# EAGLE design PayloadV7sch (EAGLE 7.3.0)
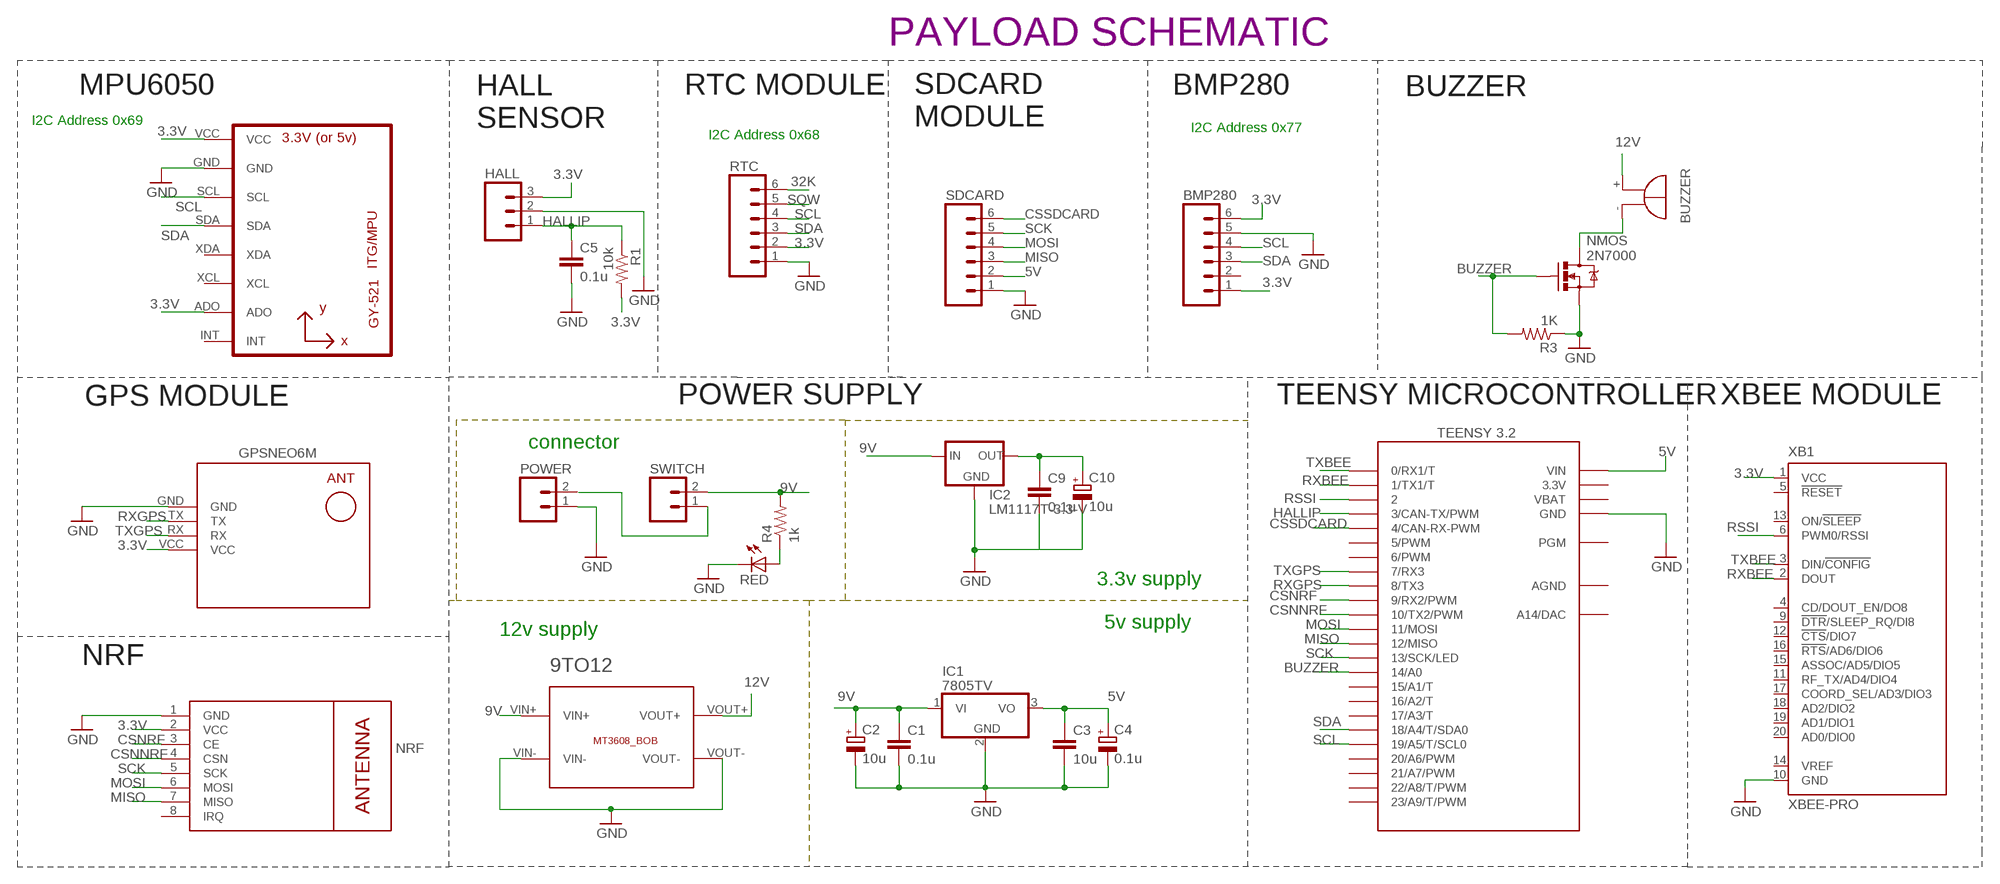
[diagram p0: schematic, sheet 1]

## Parts
9TO12  BREAKOUTS_MT3608_BOB  [BREAKOUTS_MT3608_BOB]
BMP280  M06  [06P]
C1  0.1u  C-EU025-025X050  [C025-025X050]
C2  10u  CPOL-EUE2.5-6  [E2,5-6]
C3  10u  C-EU025-025X050  [C025-025X050]
C4  0.1u  CPOL-EUE2.5-6  [E2,5-6]
C5  0.1u  C-EU025-025X050  [C025-025X050]
C9  0.1u  C-EU025-025X050  [C025-025X050]
C10  10u  CPOL-EUE2.5-6  [E2,5-6]
HALL  M03  [03P]
IC1  7805TV  [TO220V]
IC2  LM1117T-3.3-V  [TO220V]
M1  WIRELESS-NRF24L01  [WIRELESS-NRF24L01]
POWER  CEDT_JANUARY_2015_V5_M02  [CEDT_JANUARY_2015_V5_02P]
Q1  SPARKFUN-DISCRETESEMI_MOSFET-NCHANNEL2N7000  [SPARKFUN-DISCRETESEMI_TO-92]
R1  10k  R-US_0204/7  [0204/7]
R3  1K  R-US_0204/7  [0204/7]
R4  1k  R-US_0204/7  [0204/7]
RED  red  LED3MM  [LED3MM]
RTC  M06  [06P]
SDCARD  M06  [06P]
SG1  BUZZER_EB2209A  [BUZZER_EB2209A]
SWITCH  CEDT_JANUARY_2015_V5_M02  [CEDT_JANUARY_2015_V5_02P]
U1  GY-521MPU6050  [GY-521]
U$2  TEENSY_3.1-3.2_OUTER_ROW  [TEENSY_3.0-3.2&LC_OUTER_ROW]
U$3  GPS-RECEIVER-NEO6M  [GPS-RECEIVER-NEO6M]
XB1  XBEE-PRO  [XBEE-PRO]

## Nets
3.3V: BMP280.1 BMP280.6 C9.1 C10.+ HALL.3 IC2.2(OUT) M1.2(VCC) R1.2 RTC.2 U1.ADO U1.VCC U$3.VCC XB1.1(VCC)
5V: C3.1 C4.+ IC1.3(VO) SDCARD.2 U$2.VIN
9V: 9TO12.VIN+ C1.1 C2.+ IC1.1(VI) IC2.3(IN) R4.2
12V: 9TO12.VOUT+ SG1.+
32K: RTC.6
BUZZER: Q1.2(G) R3.2 U$2.14/A0
CSNNRF: M1.4(CSN) U$2.10(10/TX2/PWM)
CSNRF: M1.3(CE) U$2.9(9/RX2/PWM)
CSSDCARD: SDCARD.6 U$2.4(4/CAN-RX-PWM)
GND: 9TO12.VIN- 9TO12.VOUT- BMP280.5 C1.2 C2.- C3.2 C4.- C5.2 C9.2 C10.- HALL.2 IC1.2(GND) IC2.1(GND) M1.1(GND) POWER.1 Q1.1(S) R3.1 RED.K(C) RTC.1 SDCARD.1 U1.GND U$2.GND U$2.GND1(GND) U$3.GND XB1.10(GND)
HALLIP: C5.1 HALL.1 R1.1 U$2.3(3/CAN-TX/PWM)
MISO: M1.7(MISO) SDCARD.3 U$2.12(12/MISO)
MOSI: M1.6(MOSI) SDCARD.4 U$2.11(11/MOSI)
N$2: R4.1 RED.A
N$3: Q1.3(D) SG1.-
RSSI: U$2.2 XB1.6(PWM0/RSSI)
RXBEE: U$2.1(1/TX1/T) XB1.2(DOUT)
RXGPS: U$2.8(8/TX3) U$3.TX
SCK: M1.5(SCK) SDCARD.5 U$2.13(13/SCK/LED)
SCL: BMP280.4 RTC.4 U1.SCL U$2.19/A5(19/A5/T/SCL0)
SDA: BMP280.3 RTC.3 U1.SDA U$2.18/A4(18/A4/T/SDA0)
SQW: RTC.5
TXBEE: U$2.0(0/RX1/T) XB1.3(DIN/!CONFIG)
TXGPS: U$2.7(7/RX3) U$3.RX
Unconnected: BMP280.2 M1.8(IRQ) POWER.2 SWITCH.1 SWITCH.2 U1.INT U1.XCL U1.XDA U$2.5(5/PWM) U$2.6(6/PWM) U$2.15/A1(15/A1/T) U$2.16/A2(16/A2/T) U$2.17/A3(17/A3/T) U$2.20/A6(20/A6/PWM) U$2.21/A7(21/A7/PWM) U$2.22/A8(22/A8/T/PWM) U$2.23/A9(23/A9/T/PWM) U$2.PGM U$2.RESET/DAC(A14/DAC) XB1.4(CD/DOUT_EN/DO8) XB1.5(!RESET) XB1.9(!DTR!/SLEEP_RQ/DI8) XB1.11(RF_TX/AD4/DIO4) XB1.12(!CTS!/DIO7) XB1.13(ON/!SLEEP) XB1.14(VREF) XB1.15(ASSOC/AD5/DIO5) XB1.16(!RTS!/AD6/DIO6) XB1.17(COORD_SEL/AD3/DIO3) XB1.18(AD2/DIO2) XB1.19(AD1/DIO1) XB1.20(AD0/DIO0)

## Notes on the sheet
- PAYLOAD SCHEMATIC
- MPU6050 | RTC MODULE | BMP280 | BUZZER
- I2C Address 0x69
- SDCARD
  MODULE
- HALL
  SENSOR
- I2C Address 0x77
- I2C Address 0x68
- GPS MODULE | POWER SUPPLY | TEENSY MICROCONTROLLER | XBEE MODULE
- connector
- 3.3v supply
- 5v supply
- 12v supply
- NRF

## Power pins joined to a net without a drawn wire
3.3V: U$2.3.3V U$2.3.3V1(3.3V)
AGND: U$2.AGND
VBAT: U$2.VBAT

## Library data of the parts
9TO12 = Cansat2019_3279_Container_v01:BREAKOUTS_MT3608_BOB
BMP280 RTC SDCARD = con-amp-quick:M06: AMP QUICK CONNECTOR; OC_FARNELL: unknown; OC_NEWARK: unknown
C1 C3 C5 C9 = resistor:C-EU: CAPACITOR, European symbol
C2 C4 C10 = rcl:CPOL-EU: POLARIZED CAPACITOR, European symbol; SPICEPREFIX: C
HALL = con-amp-quick:M03: AMP QUICK CONNECTOR; OC_FARNELL: unknown; OC_NEWARK: unknown
IC1 = linear:78*: Positive VOLTAGE REGULATOR Source: http://cache.national.com/ds/LM/LM78L05.pdf http://www.fairchildsemi.com/ds/LM/LM7805.pdf
IC2 = lm1117:LM1117T-*
M1 = diy-modules:WIRELESS-NRF24L01: 2.4 GHz Wireless Module based on NRF24L01 chip More details available here: http://www.electrodragon.com/w/NRF24L01 Click here to find device on ebay.com <http://www.ebay.com/sch/nrf24l01+arduino>
POWER SWITCH = Cansat2019_3279_Container_v01:CEDT_JANUARY_2015_V5_M02: AMP QUICK CONNECTOR
Q1 = Cansat2019_3279_Container_v01:SPARKFUN-DISCRETESEMI_MOSFET-NCHANNEL: Common NMOSFET Parts MFG P/N Store ID Prod ID FDD8780 TRANS-09984 SI7820DN TRANS-11055 FDS6630A IC-08089 2N7002PW TRANS-11151 FQP30N06L COM-10213 TRANS-10060 BSS123LT1G TRANS-08345 BSS138 TRANS-00830 BS170 2N7000
R1 R3 R4 = rcl:R-US_: RESISTOR, American symbol; SPICEPREFIX: R
RED = CEDT_JANUARY_2015_v5:LED
SG1 = Cansat2019_3279_Container_v01:BUZZER_EB2209A: BUZZER Source: Buerklin; OC_FARNELL: unknown; OC_NEWARK: unknown
U1 = gy-521:GY-521
U$2 = Teensy_3_and_LC_Series_Boards_v1.4:TEENSY_3.1-3.2_OUTER_ROW: Footprint for Teensy 3.1 or 3.2 board using all pin connections on the outer perimeter
U$3 = diy-modules:GPS-RECEIVER-NEO6M: GPS Receiver Module based on NEO-6 device Short tutorial how to use NEO-6 module with Arduino: http://www.xarg.org/2016/06/neo6mv2-gps-module-with-arduino/ NEO-6 datasheet is available here: https://www.u-blox.com/sites/default/files/products/documents/NEO-6_DataSheet_%28GPS.G6-HW-09005%29.pdf Click here to find device on ebay.com <http://www.ebay.com/sch/gyneo6mv2>
XB1 = maxstream:XBEE: XBee (TM) /XBee-PRO(TM) OEM RF Modules Source: MaxStream, Inc. xbee_productmanual.pdf; MPN: XBP24-AWI-001; OC_FARNELL: 1337916; OC_NEWARK: 42M2667

## Board
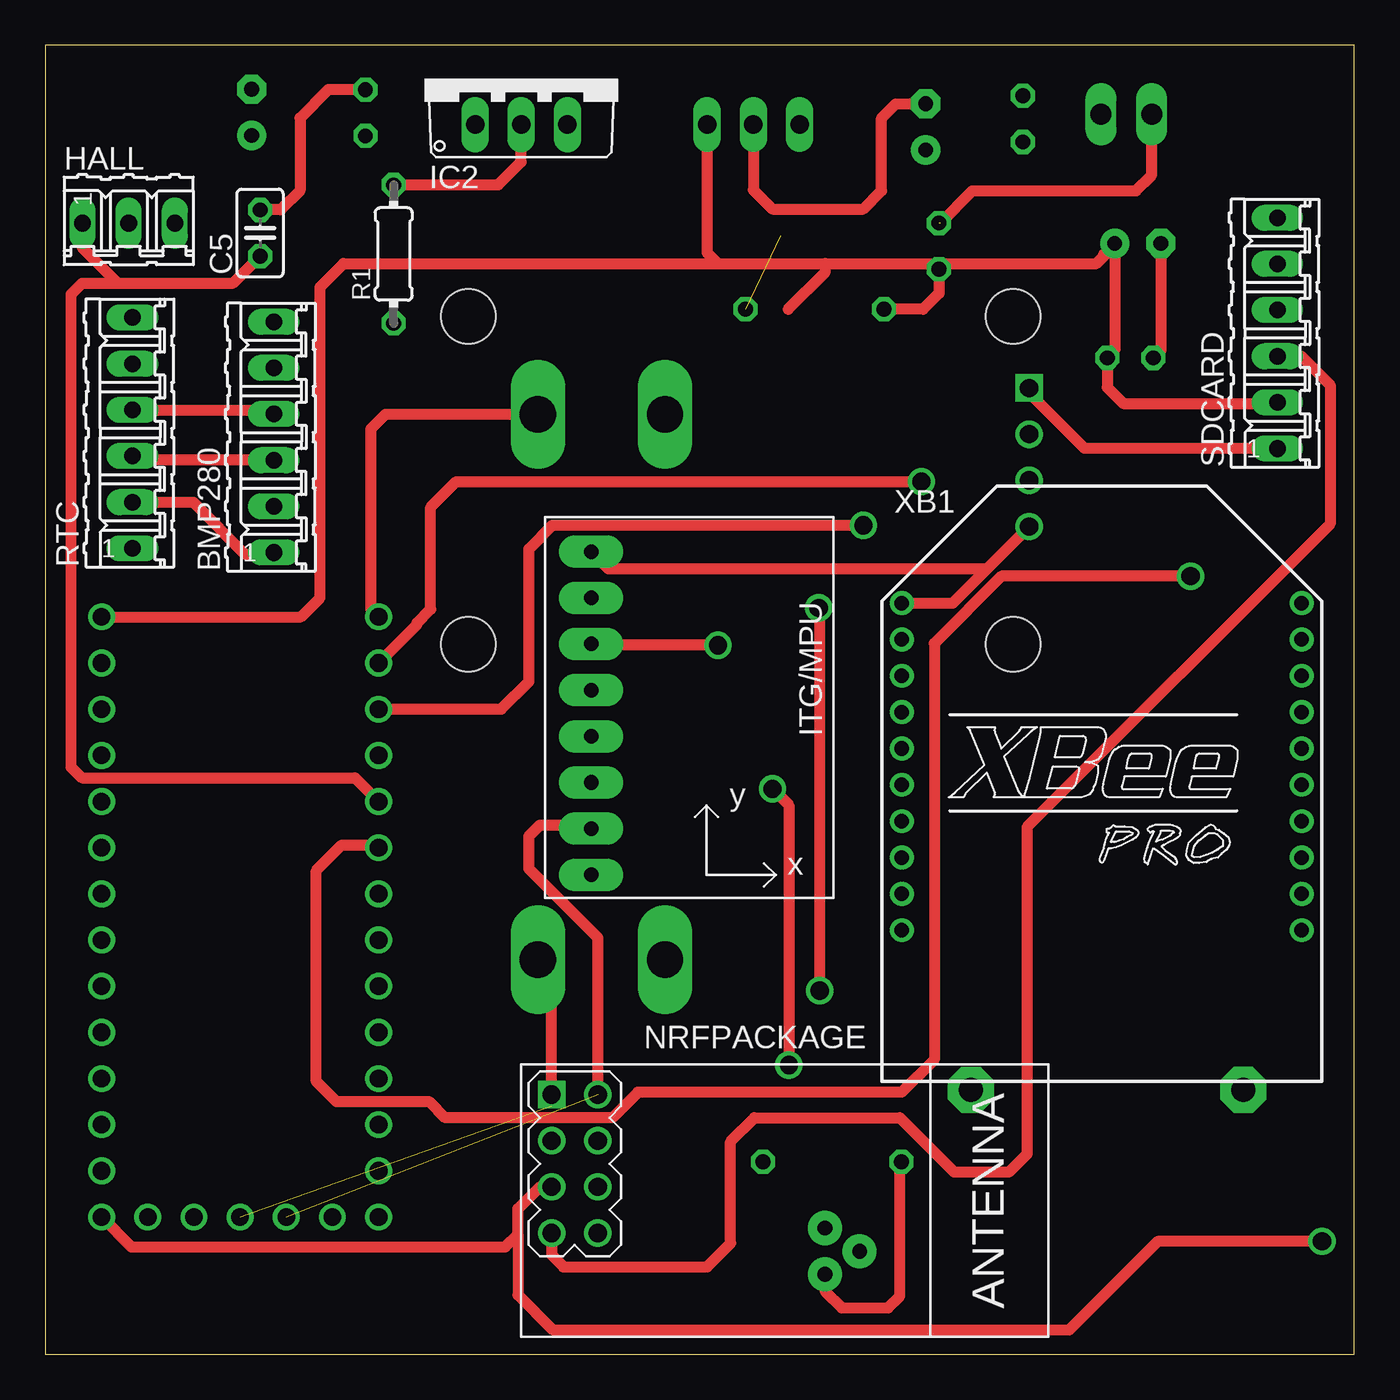
[diagram p1: board, top side]
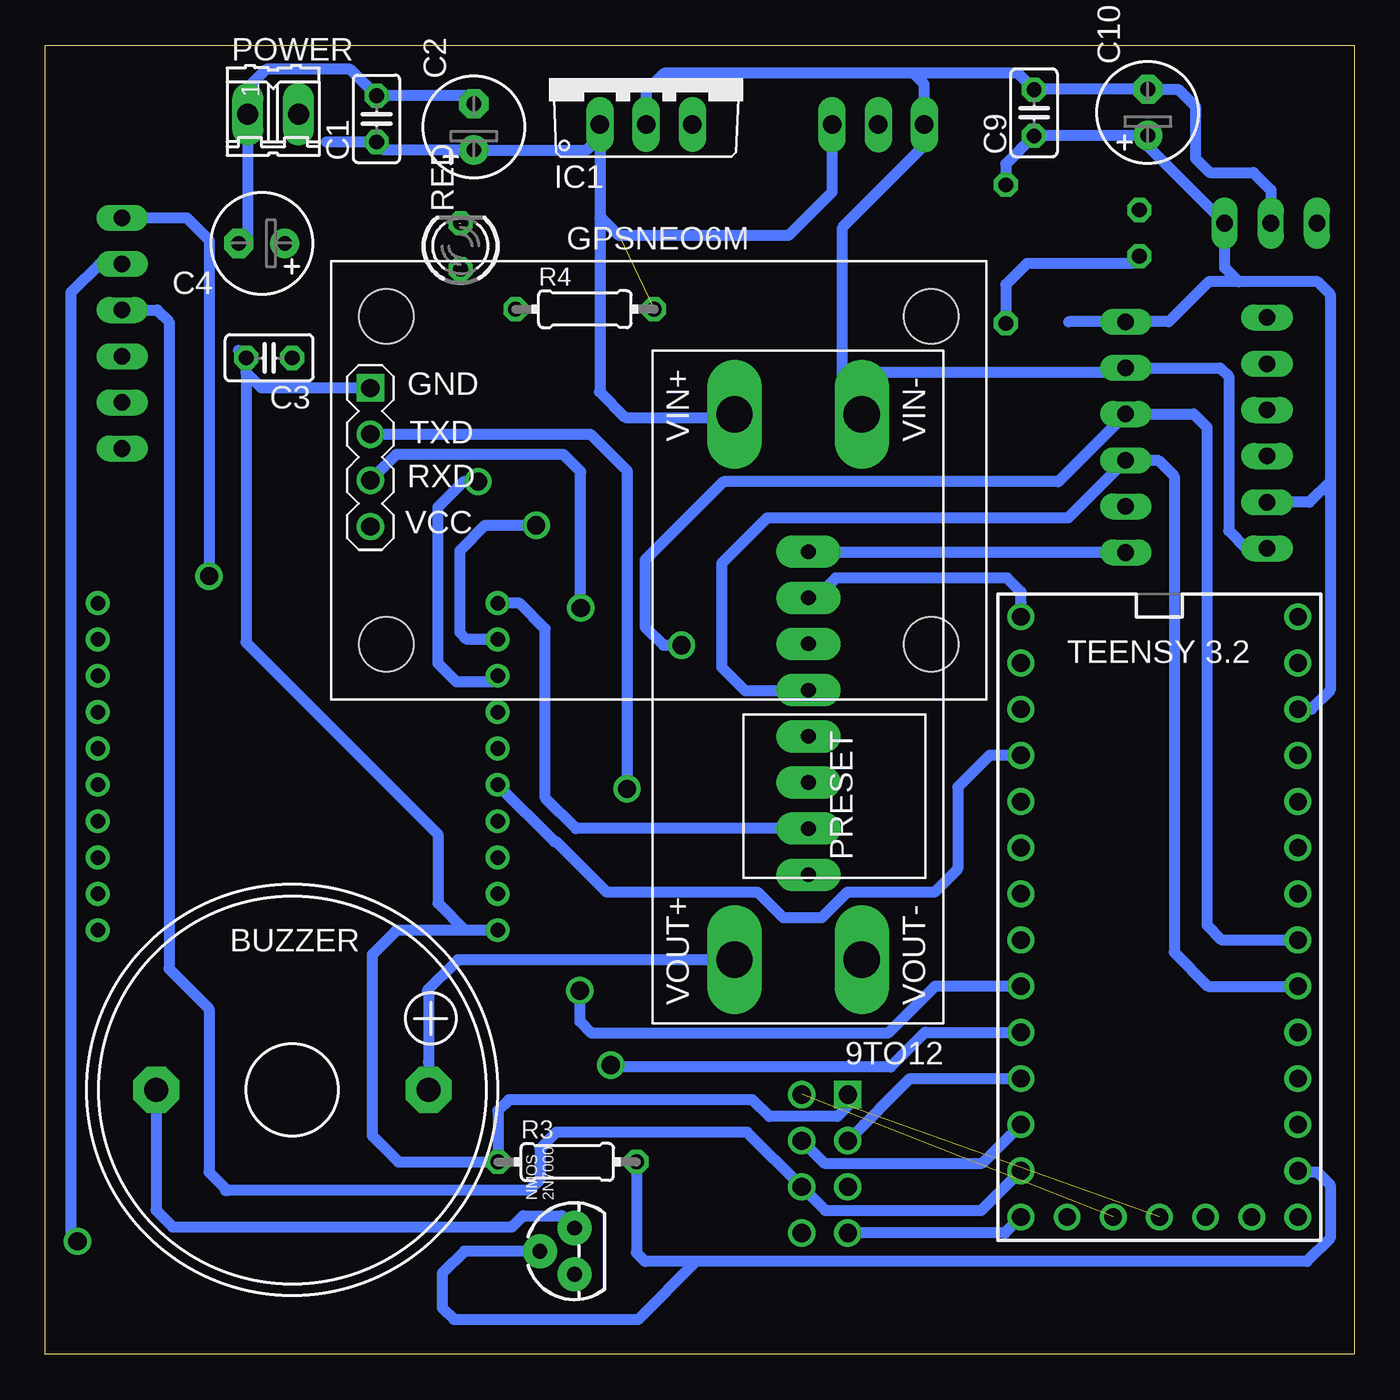
[diagram p2: board, bottom side, seen from below]

Size 72 x 72 mm. Coordinates in mm from the lower left corner, seen from the top.
Outline: 0,0 72,0 72,72 0,72 0,0
Copper layers (1*16): Top 0.035mm / dielectric 1.5mm / Bottom 0.035mm
Design rules "default *": minimum track width 6mil, minimum drill 0.35mm, track to track 6mil, track to pad 6mil, pad to pad 6mil, via to via 6mil, smd to smd 6mil, copper to edge 40mil, drill to drill 6mil, minimum pad ring 10mil, minimum via ring 8mil, stop-mask expansion 4mil, vias tented up to drill 0mil, thermal gap 10mil

### Footprints (pad centres in the part's own frame; a part is rotated, then mirrored left to right if it is on the bottom)
BREAKOUTS_MT3608_BOB = drill 2 pad 3 long: VIN+ 33.5,-4.5; VIN- 33.5,-11.5; VOUT+ 3.5,-4.5; VOUT- 3.5,-11.5
06P = drill 0.914 long: 1 -6.35,0; 2 -3.81,0; 3 -1.27,0; 4 1.27,0; 5 3.81,0; 6 6.35,0
C025-025X050 = drill 0.813 octagon: 1 -1.27,0; 2 1.27,0
E2,5-6 = drill 0.813 pad 1.6: + -1.27,0 | drill 0.813 pad 1.6 octagon: - 1.27,0
03P = drill 0.914 long: 1 -2.54,0; 2 0,0; 3 2.54,0
TO220V = drill 1.016 long: 1 -2.54,-2.54; 2 0,-2.54; 3 2.54,-2.54
WIRELESS-NRF24L01 = drill 1 square: 1 -12.7,6.35 | drill 1: 2 -10.16,6.35; 3 -12.7,3.81; 4 -10.16,3.81; 5 -12.7,1.27; 6 -10.16,1.27; 7 -12.7,-1.27; 8 -10.16,-1.27
CEDT_JANUARY_2015_V5_02P = drill 1.143 long: 1 -1.397,0; 2 1.397,0
SPARKFUN-DISCRETESEMI_TO-92 = drill 0.813 pad 1.88: 1 -1.27,0; 2 0,1.905; 3 1.27,0
0204/7 = drill 0.813 octagon: 1 -3.81,0; 2 3.81,0
LED3MM = drill 0.813 octagon: A -1.27,0; K 1.27,0
BUZZER_EB2209A = drill 1.321 pad 2.54 octagon: + 7.493,0; - -7.493,0
GY-521 = drill 0.8 pad 1.778 long: ADO -8.89,-6.35; GND -8.89,6.35; INT -8.89,-8.89; SCL -8.89,3.81; SDA -8.89,1.27; VCC -8.89,8.89; XCL -8.89,-3.81; XDA -8.89,-1.27
TEENSY_3.0-3.2&LC_OUTER_ROW = drill 0.965: 0 -7.62,13.97; 1 -7.62,11.43; 2 -7.62,8.89; 3 -7.62,6.35; 3.3V 7.62,11.43; 3.3V1 -2.54,-16.51; 4 -7.62,3.81; 5 -7.62,1.27; 6 -7.62,-1.27; 7 -7.62,-3.81; 8 -7.62,-6.35; 9 -7.62,-8.89; 10 -7.62,-11.43; 11 -7.62,-13.97; 12 -7.62,-16.51; 13 7.62,-16.51; 14/A0 7.62,-13.97; 15/A1 7.62,-11.43; 16/A2 7.62,-8.89; 17/A3 7.62,-6.35; 18/A4 7.62,-3.81; 19/A5 7.62,-1.27; 20/A6 7.62,1.27; 21/A7 7.62,3.81; 22/A8 7.62,6.35; 23/A9 7.62,8.89; AGND 7.62,13.97; GND -7.62,16.51; GND1 0,-16.51; PGM 2.54,-16.51; RESET/DAC 5.08,-16.51; VBAT -5.08,-16.51; VIN 7.62,16.51
GPS-RECEIVER-NEO6M = drill 1 square: GND -15.875,5.08 | drill 1: RX -15.875,0; TX -15.875,2.54; VCC -15.875,-2.54 | hole 3: -14.986,9.017; -14.986,-9.017; 14.986,-9.017; 14.986,9.017
XBEE-PRO = drill 0.8 pad 1.27: 1 -11,9; 2 -11,7; 3 -11,5; 4 -11,3; 5 -11,1; 6 -11,-1; 7 -11,-3; 8 -11,-5; 9 -11,-7; 10 -11,-9; 11 11,-9; 12 11,-7; 13 11,-5; 14 11,-3; 15 11,-1; 16 11,1; 17 11,3; 18 11,5; 19 11,7; 20 11,9

### Placement (x,y rotation side)
9TO12  38.59,18.2 90 bottom
BMP280  12.56,50.45 90 top
C1  53.78,67.96 90 bottom
C2  48.43,67.52 90 bottom
C3  59.69,54.81 180 bottom
C4  60.1,61.11 180 bottom
C5  11.81,61.68 90 top
C9  17.61,68.3 90 bottom
C10  11.35,68.31 90 bottom
HALL  4.58,62.22 0 top
IC1  38.95,70.2 0 bottom
IC2  26.18,70.18 0 top
M1  40.55,7.93 0 top
POWER  59.47,68.22 0 bottom
Q1  42.89,5.66 90 bottom
R1  19.16,60.52 90 top
R3  43.29,10.57 0 bottom
R4  42.32,57.49 0 bottom
RED  49.16,60.96 90 bottom
RTC  4.78,50.68 90 top
SDCARD  67.78,56.17 90 top
SG1  58.42,14.53 0 bottom
SWITCH  -7,3 90 top  (outside the outline)
U1  38.91,35.26 0 top
U$2  10.71,24.05 0 bottom
U$3  38.25,48.07 0 bottom
XB1  58.12,32.32 0 top

### Tracks (layer width: path | path; a pad name or v marks a point on that pad's centre or on a via)
3.3V  (1 unrouted)
  Top 0.61: RTC.2 8.13,46.87 11,44 12,44 12.1,44.1 BMP280.1 | XB1.1 49.91,41.32 51.8,43.2 | 51.8,43.2 U$3.VCC | M1.2 30.39,22.91 26.6,26.7 26.6,28.5 27.2,29.1 29.83,29.1 U1.ADO | 51.8,43.2 30.97,43.2 U1.VCC | R1.2 24.92,64.33 26.18,65.59 IC2.2
  Bottom 0.61: 15.7,56.8 BMP280.6 10.2,56.8 8,59 6.35,59 | 1.32,48 1.32,58.32 2,59 6.35,59 | 1.32,48 2.45,46.87 RTC.2 | BMP280.1 29.97,44.1 U1.VCC | U1.ADO 42.81,28.91 44.5,30.6 44.5,39.9 45.92,41.32 XB1.1 | 6.35,59 7.12,59.77 HALL.3 11.35,66.45 C10.+ 17.59,67.05 C9.1 19.16,65.47 R1.2 | 1.32,48 1.32,36.51 2.35,35.48 U$2.3.3V
5V
  Top 0.61: 58.22,60.5 C4.+ 58.83,61 | 58.83,61 58.83,55.22 C3.1 58.42,53.18 59.3,52.3 67.72,52.3 SDCARD.2 | 37,60 16.4,60 15.1,58.7 15.1,41.6 14.06,40.56 U$2.VIN | 37,60 42.91,60 | 42.91,60 57.83,60 58.83,61 | IC1.3 36.41,60.59 37,60 | 42.91,60 42.91,59.54 40.86,57.49
9V  (1 unrouted)
  Bottom 0.61: IC1.1 41.49,67 | 41.49,67 41.49,62.48 | 41.49,62.48 41.49,52.98 41.52,52.95 40.1,51.53 34.26,51.53 9TO12.VIN+ | 56.54,66.69 C1.1 53.34,66.25 C2.+ 42.24,66.25 41.49,67 | IC2.3 28.72,63.94 31.12,61.54 40.44,61.54 41.37,62.48 41.49,62.48
12V
  Bottom 0.61: 50.93,16.07 SG1.+ 50.93,19.93 51,20 49.47,21.53 49.3,21.7 9TO12.VOUT+
BUZZER
  Bottom 0.61: U$2.14/A0 3.01,10 2,10 1.32,9.32 1.32,6.38 2.6,5.1 36.2,5.1 | 36.2,5.1 39,5.1 39.48,5.58 R3.2 | Q1.2 48.95,5.66 50.16,4.45 50.16,2.54 49.53,1.91 39.37,1.91 39.37,1.93 36.2,5.1
CSNNRF
  Bottom 0.61: M1.4 29.15,10.5 20.45,10.5 U$2.10
CSNRF
  Bottom 0.61: 26.97,12.62 M1.3 24.43,15.16 U$2.9
CSSDCARD  (via drill 1 pad 1.5)
  Top 0.61: v63,42.8 52.6,42.8 48.9,39.1 48.9,16.2 47.1,14.4 32.6,14.4 31.2,13 22,13 21.1,13.9 16,13.9 14.9,15 14.9,26.6 16.3,28 18.19,28 U$2.4
  Bottom 0.61: SDCARD.6 64.22,62.52 63,61.3 v63,42.8
GND  (2 unrouted)
  Top 0.61: R3.1 47,10.47 47,3.19 46.35,2.54 43.81,2.54 42.89,3.46 Q1.1 | C4.- 61.37,55.22 C3.2 | SDCARD.1 57.18,49.82 54.12,52.88 U$3.GND | 9TO12.VIN- 18.7,51.7 17.9,50.9 17.9,40.99 U$2.GND | M1.1 27.85,20.94 9TO12.VOUT- | IC1.2 38.95,64.05 40,63 45,63 46,64 46,68 46.79,68.79 C2.- | C9.2 15.56,69.56 14,68 14,64 12.95,62.95 C5.2 | 49.23,62.23 51,64 60,64 60.87,64.87 POWER.1
  Bottom 0.61: 61.37,55.22 C3.2 | C3.2 60.96,54 60.11,53.15 U$3.GND | 27.2,51.8 28.14,52.75 28.14,62 23.64,66.5 IC2.1 23.64,69.86 24.25,70.46 | 27.2,51.8 9TO12.VIN- | 18.33,41.33 U$2.GND 18.33,41.93 19.1,42.7 28.51,42.7 29.6,41.61 U1.GND | 27.2,51.8 27.2,52.8 26,54 12.82,54 BMP280.5 7.36,54.26 6.9,53.8 6.9,45.3 5.93,44.33 RTC.1 | XB1.10 48.9,23.32 | 48.9,23.32 52.68,23.32 54,22 54,12 52.57,10.57 R3.1 47.1,13.4 46.5,14 33.1,14 32.17,13.07 28.43,13.07 27.85,13.65 M1.1 | C3.2 60.96,39.16 50.4,28.6 50.4,24.82 48.9,23.32 | HALL.2 4.58,63.92 4.58,64.05 5.54,65.01 7.95,65.01 8.73,65.8 8.73,68.64 9.67,69.58 C10.- 17.59,69.58 C9.2 18.5,70.46 24.25,70.46 | C2.- 48.87,69.23 C1.2 55.23,70.68 59.85,70.68 60.87,69.66 POWER.1 60.87,61.61 C4.- | 24.25,70.46 37.97,70.46 38.95,69.48 IC1.2
HALLIP
  Top 0.61: U$2.3 17.03,31.7 2,31.7 1.4,32.3 1.4,58.3 2,58.9 4,58.9 | C5.1 10.3,58.9 4,58.9 | HALL.1 2.04,60.86 4,58.9
  Bottom 0.61: C5.1 12.22,60 18,60 19.16,58.84 R1.1
MISO
  Top 0.61: SDCARD.3 69.1,54.9 70.68,53.32 70.68,45.68 54,29 54,11 53,10 50,10 47,13 39,13 37.7,11.7 37.7,6.1 36.4,4.8 28.5,4.8 27.85,5.45 M1.7
  Bottom 0.61: U$2.12 19.21,6.66 M1.7
MOSI
  Bottom 0.61: U$2.11 20.51,7.9 29.09,7.9 M1.6 33.39,12.2 43.9,12.2 44.8,11.3 44.8,9.6 45.4,9 62,9 | SDCARD.4 65.84,57.44 65.2,56.8 65.2,21.2 63,19 63,10 62,9 | 62,9 62.1,9
N$2
  Top 0.61: RED.A 49.16,58.36 48.28,57.49 R4.1
N$3
  Bottom 0.61: SG1.- 65.91,7.91 65,7 46.34,7 45.72,7.62 43.58,7.62 Q1.3
RSSI
  Bottom 0.61: XB1.6 44,28.2 43.9,28.2 41.1,25.4 32.8,25.4 31.4,24 29.3,24 27.9,25.4 23.1,25.4 21.8,26.7 21.8,31.2 20.06,32.94 U$2.2
RXBEE  (via drill 1 pad 1.5)
  Top 0.61: v45,45.6 27.9,45.6 26.6,44.3 26.6,37 25.08,35.48 U$2.1
  Bottom 0.61: XB1.2 48.82,39.32 49.2,39.7 49.2,44.2 47.8,45.6 v45,45.6
RXGPS  (via drill 1 pad 1.5)
  Top 0.61: v40,31.1 40.9,30.2 v40.9,15.9
  Bottom 0.61: U$3.TX 42.01,50.61 40,48.6 v40,31.1 | U$2.8 23.6,17.7 25.5,15.8 40.8,15.8 v40.9,15.9
SCK  (via drill 1 pad 1.5)
  Top 0.61: 26,6.6 26,8 27.2,9.2 M1.5 | v70.23,6.2 61.2,6.2 56.32,1.32 27.94,1.32 26,3.26 26,6.6 | U$2.13 4.73,5.9 25.3,5.9 26,6.6
  Bottom 0.61: SDCARD.5 69.02,59.98 70.6,58.4 70.6,6.57 v70.23,6.2
SCL  (via drill 1 pad 1.5)
  Top 0.61: RTC.4 12.33,51.95 BMP280.4 | v37,39 30.09,39 U1.SCL
  Bottom 0.61: v37,39 38,39 39,40 39,43.7 34.7,48 16.28,48 BMP280.4 8.82,51.72 8.1,51 8.1,23.6 7.3,22.8 3.11,22.8 U$2.19/A5
SDA
  Top 0.61: BMP280.3 4.18,49.18 | 4.18,49.18 4,49 | 4.18,49.18 4.41,49.41 RTC.3 | 29.95,36.6 U1.SDA
  Bottom 0.61: U1.SDA 30.05,36.5 33.5,36.5 34.8,37.8 34.8,43.5 32.3,46 15.74,46 15.37,46.37 BMP280.3 10.78,49.18 9.9,48.3 9.9,22.1 8.04,20.24 U$2.18/A4
TXBEE  (via drill 1 pad 1.5)
  Top 0.61: v48.2,48 22.6,48 21.2,46.6 21.2,40.98 20.44,40.22 20.44,40.13 U$2.0
  Bottom 0.61: v48.2,48 49,48 50.41,46.59 50.41,38.02 49.4,37 47.44,37 XB1.3
TXGPS  (via drill 1 pad 1.5)
  Top 0.61: v42.6,19.99 42.6,41 v42.55,41.05
  Bottom 0.61: U$2.7 23.06,20.24 25.65,17.65 41.95,17.65 42.6,18.3 v42.6,19.99 | U$3.RX 52.7,49.5 43.5,49.5 42.55,48.55 v42.55,41.05